# EasyEDA Pro project wireless charger controller.eprj, board PCB9
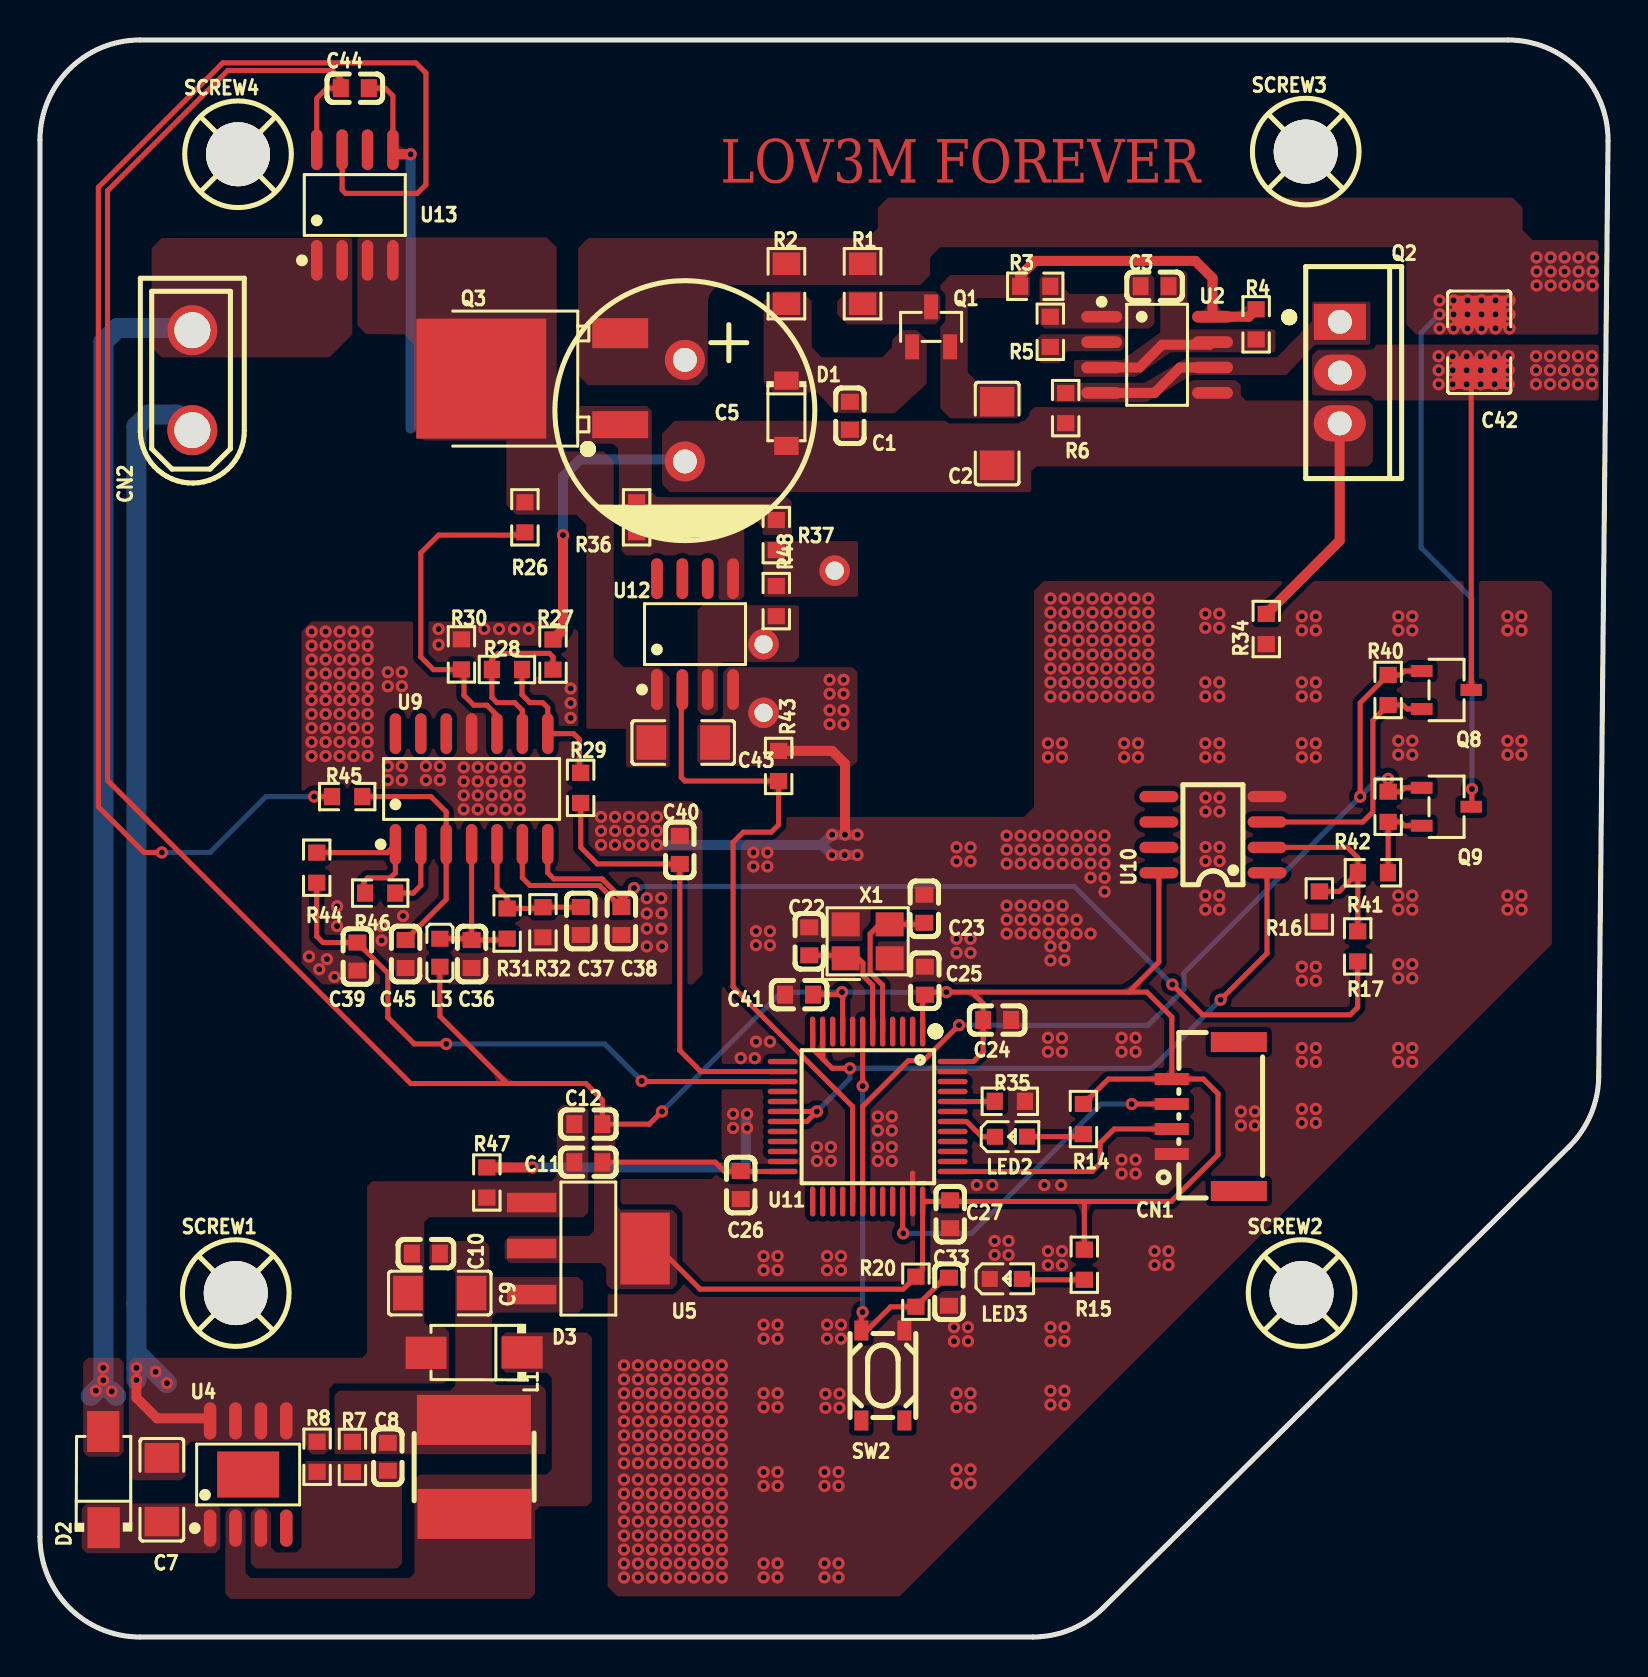
[diagram p10: board, top side]
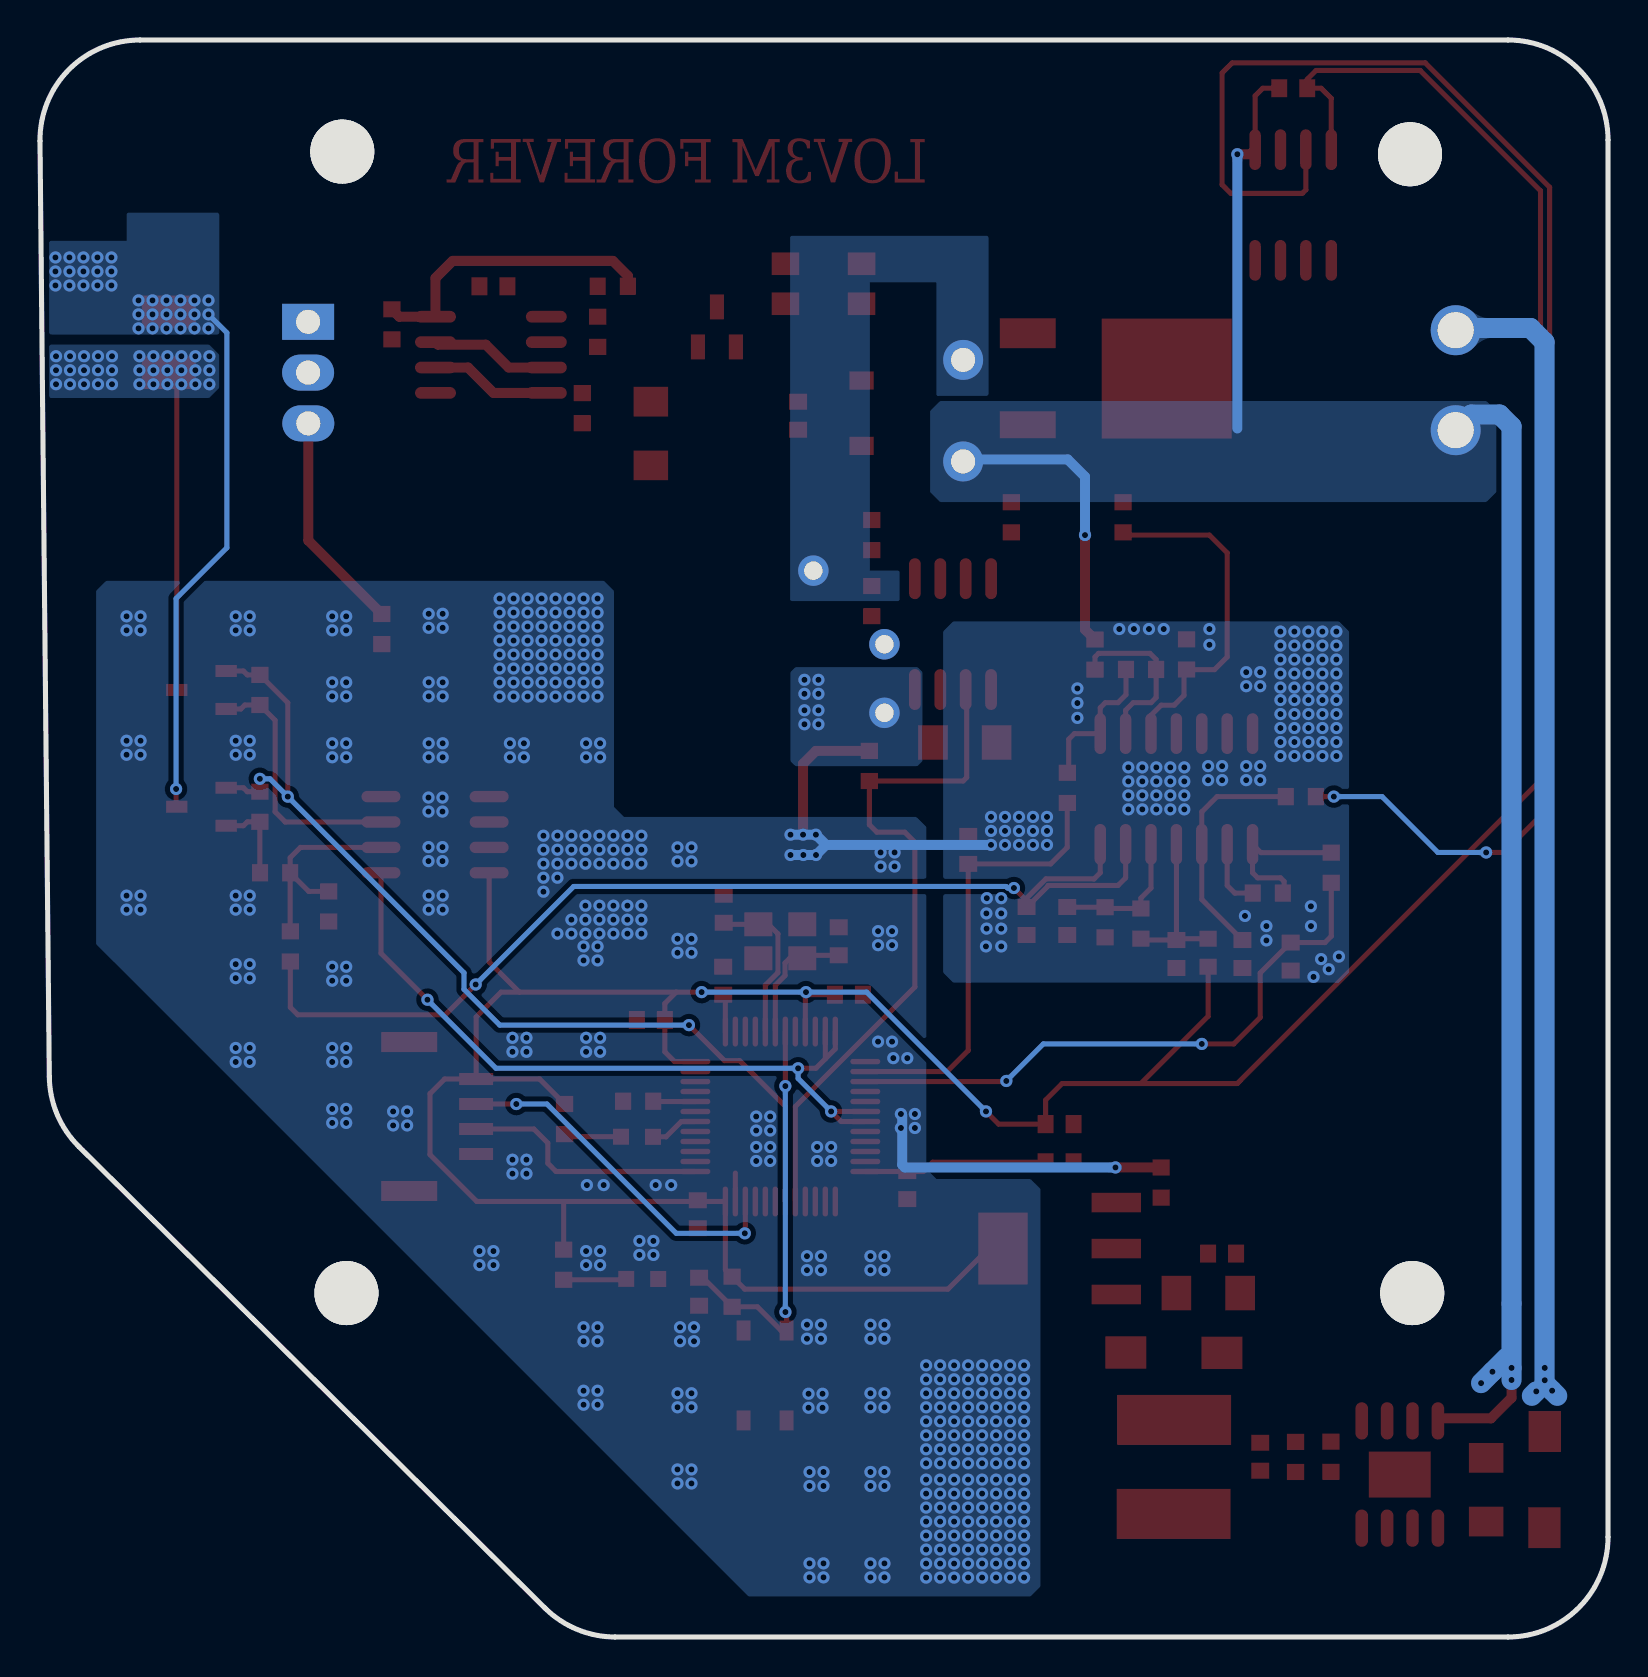
[diagram p11: board, bottom side, seen from below]

Outline 78.44 x 79.88 mm; copper layers: Top Layer, Bottom Layer. Coordinates in mm from the lower left corner of the outline.
Outline path: 0,74.88 0,5 arc(1.46,1.46) 5,0 49.66,0 arc(51.56,0.38) 53.17,1.45 76.49,24.53 arc(77.58,26.13) 77.97,28.03 78.44,74.83 arc(76.99,78.4) 73.44,79.88 5,79.88 arc(1.46,78.42) 0,74.88
Stack: Top Layer 0.035mm / Dielectric1 1.51mm FR4 er 4.5 / Bottom Layer 0.035mm

## Design rules (mm)
template: 自定义配置
spacing copperThickness1oz (default): track to track 0.102, other pairs 0.152 to 0.3
spacing copperThickness2oz: track to track 0.203, other pairs 0.152 to 0.3
track width copperThickness1oz (default): min 0.127, default 0.254, max 2.54
track width copperThickness2oz: min 0.203, default 0.254, max 2.54
differential pair differentialPair (default): width min 0.127, default 0.254, max 2.54; gap min 0.152, default 0.152
via viaSize (default): diameter min 0.5, default 0.61, max 10; hole min 0.3, default 0.305, max 6.3
net NET1 uses copperRegion1
net WGND uses copperRegion1
net NET2 uses copperRegion1
net $1N4125 uses copperRegion1
net $1N4124 uses copperRegion1
net $1N4176 uses copperRegion1
net $1N4254 uses copperRegion1
net +9.5V uses copperRegion1
net +3.3V uses copperRegion1
net GND uses copperRegion1
net INFORMATION+ uses copperRegion1
net 36V uses copperRegion1
net $1N4178 uses copperRegion1
net NET3 uses copperRegion1
net $1N4257 uses copperRegion1
net $1N4264 uses copperRegion1
net $1N4126 uses copperRegion1
net +36V uses copperRegion1
net GH uses copperRegion1
net HSO uses copperRegion1
net HSI uses copperRegion1

## Placement (name value [footprint] x y rotation side)
C1  100nF  [C0603]  40.51 61.09 90 top
C2  47uF  [C1206]  47.88 60.2 90 top
C3  1nF  [C0603]  55.75 67.56 180 top
C5  1000uF  [CAP-TH_BD13.0-P5.00-D1.2-FD]  32.26 61.34 270 top
C7  10uF  [C1206]  6.1 7.37 270 top
C8  33nF  [C0603]  17.4 9.02 270 top
C9  47uF  [C1206]  20 17.2 180 top
C10  100nF  [C0603]  19.3 19.18 180 top
C11  10uF  [C0603]  27.43 23.75 180 top
C12  100nF  [C0603]  27.43 25.65 180 top
C22  22pF  [C0603]  38.48 34.8 90 top
C23  22pF  [C0603]  44.24 36.43 270 top
C24  100nF  [C0603]  47.88 30.86 0 top
C25  100nF  [C0603]  44.26 32.83 90 top
C26  100nF  [C0603]  35.05 22.61 270 top
C27  100nF  [C0603]  45.53 21.15 270 top
C33  100nF  [C0603]  45.47 17.27 90 top
C36  100nF  [C0603]  21.59 34.16 90 top
C37  100nF  [C0603]  27.05 35.81 90 top
C38  100nF  [C0603]  29.08 35.81 90 top
C39  10nF  [C0603]  15.88 34.04 90 top
C40  10nF  [C0603]  32 39.37 90 top
C41  100nF  [C0603]  37.97 32.13 0 top
C42  47nF  [C1210]  71.99 64.76 90 top
C43  10uF  [C1206]  32.18 44.74 180 top
C44  100nF  [C0603]  15.75 77.47 0 top
C45  10nF  [C0603]  18.29 34.16 90 top
CN1  ZX-BX-GH1.25-LT4  [CONN-SMD_ZX-BX-GH1.25-LT4]  58.29 26.04 90 top
CN2  XT30UPB-M  [CONN-TH_XT30UPB-M]  7.62 62.87 90 top
D1  MMSZ5242B  [SOD-123_L2.7-W1.6-LS3.7-RD]  37.34 61.21 270 top
D2  SS510  [SMA_L4.3-W2.6-LS5.0-RD]  3.17 7.87 90 top
D3  SS510  [SMA_L4.3-W2.6-LS5.0-RD]  21.72 14.22 180 top
L1  100uH  [IND-SMD_L6.0-W6.0_FNR60XXS]  21.72 8.51 270 top
L3  10uH  [L0603]  20 34.23 270 top
LED2  NCD0603R1  [LED0603-RD_RED]  48.57 25.02 0 top
LED3  NCD0603R1  [LED0603-RD_RED]  48.31 17.91 0 top
NOREF  -  [Pad_e2022]  36.2 46.23 0 top
NOREF#2  -  [Pad_e529]  39.75 53.34 0 top
NOREF#3  -  [Pad_e1821]  36.2 49.66 0 top
Q1  MMBT5551  [SOT-23-3_L2.9-W1.3-P1.90-LS2.4-BR]  44.58 65.53 270 top
Q2  -  [IRF9540P_TO-220]  65.02 63.25 270 top
Q3  NCEP0178AK  [TO-252-2_L6.5-W6.1-P4.58-LS10.0-TL]  25.55 62.93 180 top
Q8  G01N20LE  [SOT-23-3_L2.9-W1.6-P1.90-LS2.8-BR]  70.36 47.37 180 top
Q9  G01N20LE  [SOT-23-3_L2.9-W1.6-P1.90-LS2.8-BR]  70.36 41.53 180 top
R1  330Ω  [R0805]  41.15 67.69 90 top
R2  100kΩ  [R0805]  37.34 67.69 90 top
R3  47kΩ  [R0603]  49.78 67.56 180 top
R4  47kΩ  [R0603]  60.83 65.66 90 top
R5  3.9kΩ  [R0603]  50.54 65.29 90 top
R6  20kΩ  [R0603]  51.31 61.47 90 top
R7  30kΩ  [R0603]  15.63 9.01 270 top
R8  4.7kΩ  [R0603]  13.86 9.02 270 top
R14  1kΩ  [R0603]  52.2 25.91 90 top
R15  1kΩ  [R0603]  52.24 18.62 90 top
R16  0Ω  [R0603]  63.99 36.54 90 top
R17  0Ω  [R0603]  65.91 34.54 90 top
R20  10kΩ  [R0603]  43.81 17.27 90 top
R26  15kΩ  [R0603]  24.26 56.01 90 top
R27  15kΩ  [R0603]  25.66 49.14 90 top
R28  1kΩ  [R0603]  23.36 48.4 180 top
R29  1kΩ  [R0603]  27.04 42.47 270 top
R30  1kΩ  [R0603]  21.08 49.15 90 top
R31  10kΩ  [R0603]  23.37 35.69 90 top
R32  10kΩ  [R0603]  25.16 35.75 270 top
R34  0Ω  [R0603]  61.34 50.42 90 top
R35  10kΩ  [R0603]  48.51 26.8 0 top
R36  4.7Ω  [R0603]  29.84 56.01 90 top
R37  10kΩ  [R0603]  36.83 55.12 90 top
R40  10kΩ  [R0603]  67.44 47.37 90 top
R41  0Ω  [R0603]  66.67 38.23 180 top
R42  10kΩ  [R0603]  67.44 41.53 90 top
R43  10kΩ  [R0603]  36.95 43.57 270 top
R44  100Ω  [R0603]  13.84 38.48 270 top
R45  100Ω  [R0603]  15.37 42.04 180 top
R46  10kΩ  [R0603]  17.02 37.21 180 top
R47  0Ω  [R0603]  22.35 22.73 270 top
R48  100Ω  [R0603]  36.83 51.82 270 top
SCREW1  -  [M3螺丝]  9.79 17.2 0 top
SCREW2  -  [M3螺丝]  63.11 17.2 0 top
SCREW3  -  [M3螺丝]  63.31 74.3 0 top
SCREW4  -  [M3螺丝]  9.91 74.17 0 top
SW2  TS3425BA  [SW-SMD_4P-L4.2-W3.2-P2.15-LS4.6-1]  42.16 13.08 90 top
U2  LM2904DR2G  [SOIC-8_L4.9-W3.9-P1.27-LS6.0-BL]  55.88 64.14 270 top
U4  XL7005A  [SOIC-8_L4.9-W3.9-P1.27-LS6.0-BL-EP3.1-1]  10.41 8.13 0 top
U5  SPX1117M3-L-3-3/TR  [SOT-223-4_L6.5-W3.5-P2.30-LS7.0-BR]  27.43 19.43 180 top
U9  TLV2374IDR  [SOIC-14_L8.7-W3.9-P1.27-LS6.0-BL]  21.59 42.42 0 top
U10  LM393DR  [SOIC-8_L5.0-W4.0-P1.27-LS6.0-BL]  58.67 40.13 90 top
U11  STM32F103C8T6  [LQFP-48_L7.0-W7.0-P0.50-LS9.0-BL]  41.4 26.04 180 top
U12  MX5014S  [SOIC-8_L4.9-W3.9-P1.27-LS6.0-BL]  32.77 50.17 0 top
U13  CC6920BSO-10A  [SOP-8_L5.0-W4.0-P1.27-LS6.0-BL]  15.75 71.63 0 top
X1  8MHz  [CRYSTAL-SMD_4P-L3.2-W2.5-BL]  41.4 34.8 0 top

## Footprints (pads in the part's own frame, mm; a bottom-side part is the same pattern mirrored in y, then rotated)
C0603
  rect 0.8x0.9 smd: 1(-0.7,0) 2(0.7,0)
C1206
  rect 1.485x1.728 smd: 1(-1.593,0) 2(1.593,0)
C1210
  rect 1.635x2.7 smd: 1(-1.518,0) 2(1.518,0)
CAP-TH_BD13.0-P5.00-D1.2-FD
  round 2 hole 1.2: 1(-2.54,0) 2(2.54,0)
CONN-SMD_ZX-BX-GH1.25-LT4
  rect 0.6x1.7 smd: 1(-1.875,1.675) 2(-0.625,1.675) 3(0.625,1.675) 4(1.875,1.675)
  rect 1x2.8 smd: 5(3.725,-1.675) 6(-3.725,-1.675)
CONN-TH_XT30UPB-M
  round 2.5 hole 1.8: 1(-2.5,0) 2(2.5,0)
CRYSTAL-SMD_4P-L3.2-W2.5-BL
  rect 1.4x1.2 smd: 1(-1.1,-0.85) 2(1.1,-0.85) 3(1.1,0.85) 4(-1.1,0.85)
IND-SMD_L6.0-W6.0_FNR60XXS
  rect 2.5x5.7 smd: 1(-2.35,-0.013) 2(2.35,0.013)
IRF9540P_TO-220
  rect 1.801x2.601 hole 1.199: 1(-2.54,0)
  oval 1.801x2.601 hole 1.199: 2(0,0) 3(2.54,-0.01)
L0603
  rect 0.8x0.864 smd: 1(-0.7,0) 2(0.7,0)
LED0603-RD_RED
  rect 0.8x0.8 smd: 1(-0.799,-0.004) 2(0.799,0.004)
LQFP-48_L7.0-W7.0-P0.50-LS9.0-BL
  oval 0.27x1.5 smd: 1(-2.75,-4.25) 2(-2.25,-4.25) 3(-1.75,-4.25) 4(-1.25,-4.25) 5(-0.75,-4.25) 6(-0.25,-4.25) 7(0.25,-4.25) 8(0.75,-4.25) 9(1.25,-4.25) 10(1.75,-4.25) 11(2.25,-4.25) 12(2.75,-4.25) 25(2.75,4.25) 26(2.25,4.25) 27(1.75,4.25) 28(1.25,4.25) 29(0.75,4.25) 30(0.25,4.25) 31(-0.25,4.25) 32(-0.75,4.25) 33(-1.25,4.25) 34(-1.75,4.25) 35(-2.25,4.25) 36(-2.75,4.25)
  oval 1.5x0.27 smd: 13(4.25,-2.75) 14(4.25,-2.25) 15(4.25,-1.75) 16(4.25,-1.25) 17(4.25,-0.75) 18(4.25,-0.25) 19(4.25,0.25) 20(4.25,0.75) 21(4.25,1.25) 22(4.25,1.75) 23(4.25,2.25) 24(4.25,2.75) 37(-4.25,2.75) 38(-4.25,2.25) 39(-4.25,1.75) 40(-4.25,1.25) 41(-4.25,0.75) 42(-4.25,0.25) 43(-4.25,-0.25) 44(-4.25,-0.75) 45(-4.25,-1.25) 46(-4.25,-1.75) 47(-4.25,-2.25) 48(-4.25,-2.75)
M3螺丝
  round 3.2 hole 3.2: 1(0,0)
Pad_e529
  round 1.524 hole 0.914: 1(0,0)
Pad_e1821
  round 1.524 hole 0.914: 1(0,0)
Pad_e2022
  round 1.524 hole 0.914: 1(0,0)
R0603
  rect 0.806x0.864 smd: 1(-0.753,0) 2(0.753,0)
R0805
  rect 1.133x1.377 smd: 1(-1,0) 2(1,0)
SMA_L4.3-W2.6-LS5.0-RD
  rect 2.046x1.62 smd: 1(-2.404,-0.009) 2(2.404,0.009)
SOD-123_L2.7-W1.6-LS3.7-RD
  rect 0.91x1.22 smd: 1(-1.635,0) 2(1.635,0)
SOIC-8_L4.9-W3.9-P1.27-LS6.0-BL
  oval 0.588x2.045 smd: 1(-1.905,-2.772) 2(-0.635,-2.772) 3(0.635,-2.772) 4(1.905,-2.772) 5(1.905,2.772) 6(0.635,2.772) 7(-0.635,2.772) 8(-1.905,2.772)
SOIC-8_L4.9-W3.9-P1.27-LS6.0-BL-EP3.1-1
  oval 0.63x1.865 smd: 1(-1.905,-2.683) 2(-0.635,-2.683) 3(0.635,-2.683) 4(1.905,-2.683) 5(1.905,2.683) 6(0.635,2.683) 7(-0.635,2.683) 8(-1.905,2.683)
  rect 3.1x2.3 smd: 9(0,0)
SOIC-8_L5.0-W4.0-P1.27-LS6.0-BL
  oval 0.569x1.95 smd: 1(-1.905,-2.705) 2(-0.635,-2.705) 3(0.635,-2.705) 4(1.905,-2.705) 5(1.905,2.705) 6(0.635,2.705) 7(-0.635,2.705) 8(-1.905,2.705)
SOIC-14_L8.7-W3.9-P1.27-LS6.0-BL
  oval 0.574x2.038 smd: 1(-3.81,-2.769) 2(-2.54,-2.769) 3(-1.27,-2.769) 4(0,-2.769) 5(1.27,-2.769) 6(2.54,-2.769) 7(3.81,-2.769) 8(3.81,2.769) 9(2.54,2.769) 10(1.27,2.769) 11(0,2.769) 12(-1.27,2.769) 13(-2.54,2.769) 14(-3.81,2.769)
SOP-8_L5.0-W4.0-P1.27-LS6.0-BL
  oval 0.574x2.035 smd: 1(-1.905,-2.768) 2(-0.635,-2.768) 3(0.635,-2.768) 4(1.905,-2.768) 5(1.905,2.768) 6(0.635,2.768) 7(-0.635,2.768) 8(-1.905,2.768)
SOT-23-3_L2.9-W1.3-P1.90-LS2.4-BR
  rect 1.25x0.7 smd: 1(1,-0.95) 2(1,0.95) 3(-1,0)
SOT-23-3_L2.9-W1.6-P1.90-LS2.8-BR
  rect 1.07x0.6 smd: 1(1.235,-0.95) 2(1.235,0.95) 3(-1.235,0)
SOT-223-4_L6.5-W3.5-P2.30-LS7.0-BR
  rect 2.47x0.98 smd: 1(2.835,-2.3) 2(2.835,0) 3(2.835,2.3)
  rect 2.47x3.6 smd: 4(-2.835,0)
SW-SMD_4P-L4.2-W3.2-P2.15-LS4.6-1
  rect 1x0.7 smd: 1(-2.25,1.075) 2(2.25,1.075) 3(-2.25,-1.075) 4(2.25,-1.075)
TO-252-2_L6.5-W6.1-P4.58-LS10.0-TL
  rect 2.8x1.35 smd: 1(-3.475,2.29)
  rect 2.8x1.5 smd: 3(-3.475,-2.29)
  rect 6.5x6 smd: 4(3.475,-0.017)

## Nets
As in the schematic, except:
GND: C22.2 C23.1 C24.2 C25.2 C26.2 C27.2 C33.1 C36.1 C37.1 C38.1 C39.1 C40.2 C41.1 C43.1 C45.1 CN1.1 LED3.1 NOREF.1 R16.1 R30.2 R32.2 R34.1 R35.2 R43.1 R47.1 SW2.4 U9.11 U10.4 U11.8 U11.23 U11.35 U11.47 U12.4 X1.2 X1.4
HSI: NOREF#3.1 R48.2 U12.3
HSO: C5.1 C42.2 NOREF#2.1 Q3.3 Q9.3 R1.2 R2.2 R37.1 R48.1

Pads without a net: CN1 5 6; SCREW1 1; SCREW2 1; SCREW3 1; SCREW4 1; SW2 1 3; U4 4 9; U9 12 13 14; U10 5 6 7; U11 2 3 4 10 13 16 17 20 21 22 25 26 27 28 31 32 33 38 39 40 41 43 45 46; U12 6 7 8; U13 6

## Via types
v1: diameter 0.61, hole 0.305, Top Layer to Bottom Layer, 691 vias

## Routing (per net, layer and track width the routed paths; a pad name or vN(x,y) marks a point on that pad's centre or on a via; arc(x,y) is an arc through that point)
+1.65V: length 55.6
  Top Layer w0.254: 29.08,36.83 29.08,36.96 28.12,37.92 25.71,37.92 25.4,38.23 U9.7 ; 29.08,36.83 C38.2 29.06,36.51 28.01,37.57 28.01,37.59 24.51,37.59 24.13,37.97 U9.6 ; 29.08,36.83 v1(29.72,37.47) ; v1(56.64,32.64) 58.16,31.12 65.54,31.12 65.91,31.5 R17.1
  Bottom Layer w0.254: v1(29.72,37.47) 30.04,37.47 30.11,37.54 51.74,37.54 v1(56.64,32.64)
+3.3V: length 197.5
  Top Layer w0.254: CN1.4 53.45,27.91 R14.2 ; CN1.4 56.62,31.01 55.37,32.26 54.46,32.26 ; CN1.4 58.2,27.91 58.93,27.18 58.93,24.13 56.58,21.79 52.31,21.79 ; C41.2 39.99,32.13 v1(40.12,32.26) 40.15,32.23 U11.9 ; U11.48 46.69,28.79 47.18,29.27 47.18,31.69 46.61,32.26 ; 52.31,21.79 U11.36 44.15,18.37 43.18,17.4 33.02,17.4 30.99,19.43 U5.4 ; 52.31,21.79 52.24,21.72 R15.2 ; 54.46,32.26 46.61,32.26 ; 54.46,32.26 55.97,33.77 55.97,38.23 ; v1(31.11,26.29) 30.48,25.65 C12.1 28.13,26.86 27.3,27.69 23.37,27.69 ; U13.8 13.84,76.96 14.35,77.47 C44.1 15.05,77.92 14.61,78.36 9.4,78.36 3.38,72.34 3.38,42.85 18.54,27.69 23.37,27.69 ; 46.61,32.26 v1(45.34,32.26) 44.45,32.26 44.15,31.96 U11.1 ; 23.37,27.69 20,31.05 L3.2 ; C11.1 33.78,23.75 34.25,23.29 U11.24
  Bottom Layer w0.254: v1(45.34,32.26) v1(40.12,32.26) 37.08,32.26 v1(31.11,26.29)
+36V: length 58.1
  Bottom Layer w1: CN2.2 7.51,65.48 3.88,65.48 3.17,64.77 3.17,12.7 v1(2.8,12.32) 2.54,12.06 ; v1(3.59,12.29) 3.81,12.06
  vias: v1(3.17,13.46) v1(3.17,12.84)
GND: length 36.4
  Top Layer w0.254: U11.35 43.65,23.2
  Top Layer w0.5: v1(40.27,40.13) 40.27,43.68 39.62,44.32 R43.1 ; R47.1 v1(24.64,23.49)
  Bottom Layer w0.5: v1(24.64,23.49) 35.17,23.49 35.31,23.62 35.31,26.1 v1(35.37,26.16) ; v1(30.86,39.62) 39.11,39.62 ; 39.11,39.62 v1(39.62,40.13) v1(40.27,40.13) v1(40.89,40.13) ; 39.11,39.62 v1(39.62,39.12) v1(40.25,39.12) v1(40.89,39.12)
  vias: v1(13.46,34.04) v1(13.59,50.29) v1(13.59,49.59) v1(13.59,48.89) v1(13.59,48.19) v1(13.59,47.49) v1(13.59,46.87) v1(13.59,46.17) v1(13.59,45.47) v1(13.59,44.77) v1(13.59,44.07) v1(13.97,33.4) v1(14.29,50.29) v1(14.29,49.59) v1(14.29,48.89) v1(14.29,48.19) v1(14.29,47.49) v1(14.29,46.87) v1(14.29,46.17) v1(14.29,45.47) v1(14.29,44.77) v1(14.29,44.07) v1(14.35,33.91) v1(14.73,33.02) v1(14.86,36.55) v1(14.86,35.56) v1(14.99,50.29) v1(14.99,49.59) v1(14.99,48.89) v1(14.99,48.19) v1(14.99,47.49) v1(14.99,46.87) v1(14.99,46.17) v1(14.99,45.47) v1(14.99,44.77) v1(14.99,44.07) v1(15.69,50.29) v1(15.69,49.59) v1(15.69,48.89) v1(15.69,48.19) v1(15.69,47.49) v1(15.69,46.87) v1(15.69,46.17) v1(15.69,45.47) v1(15.69,44.77) v1(15.69,44.07) v1(16.39,50.29) v1(16.39,49.59) v1(16.39,48.89) v1(16.39,48.19) v1(16.39,47.49) v1(16.39,46.87) v1(16.39,46.17) v1(16.39,45.47) v1(16.39,44.77) v1(16.39,44.07) v1(17.09,35.56) v1(17.09,34.84) v1(17.4,48.26) v1(17.4,47.56) v1(17.4,43.56) v1(17.4,42.86) v1(18.1,48.26) v1(18.1,47.56) v1(18.1,43.56) v1(18.1,42.86) v1(18.16,36.07) v1(19.3,43.56) v1(19.3,42.86) v1(19.94,50.42) v1(19.94,49.63) v1(20,43.56) v1(20,42.86) v1(21.2,43.5) v1(21.2,42.8) v1(21.2,42.1) v1(21.2,41.4) v1(21.89,43.5) v1(21.89,42.8) v1(21.89,42.1) v1(21.89,41.4) v1(22.23,50.42) v1(22.59,43.5) v1(22.59,42.8) v1(22.59,42.1) v1(22.59,41.4) v1(22.96,50.42) v1(23.3,43.5) v1(23.3,42.8) v1(23.3,42.1) v1(23.3,41.4) v1(23.72,50.42) v1(23.99,43.5) v1(23.99,42.8) v1(23.99,42.1) v1(23.99,41.4) v1(24.45,50.42) v1(26.54,47.45) v1(26.54,46.72) v1(26.54,45.97) v1(28.06,41.02) v1(28.06,40.32) v1(28.06,39.62) v1(28.76,41.02) v1(28.76,40.32) v1(28.76,39.62) v1(29.21,13.59) v1(29.21,12.89) v1(29.21,12.19) v1(29.21,11.49) v1(29.21,10.79) v1(29.21,10.09) v1(29.21,9.39) v1(29.21,8.69) v1(29.21,7.87) v1(29.21,7.17) v1(29.21,6.47) v1(29.21,5.77) v1(29.21,5.07) v1(29.21,4.37) v1(29.21,3.67) v1(29.21,2.97) v1(29.46,41.02) v1(29.46,40.32) v1(29.46,39.62) v1(29.91,13.59) v1(29.91,12.89) v1(29.91,12.19) v1(29.91,11.49) v1(29.91,10.79) v1(29.91,10.09) v1(29.91,9.39) v1(29.91,8.69) v1(29.91,7.87) v1(29.91,7.17) v1(29.91,6.47) v1(29.91,5.77) v1(29.91,5.07) v1(29.91,4.37) v1(29.91,3.67) v1(29.91,2.97) v1(30.16,41.02) v1(30.16,40.32) v1(30.16,39.62) v1(30.35,36.96) v1(30.35,36.2) v1(30.35,35.43) v1(30.35,34.54) v1(30.61,13.59) v1(30.61,12.89) v1(30.61,12.19) v1(30.61,11.49) v1(30.61,10.79) v1(30.61,10.09) v1(30.61,9.39) v1(30.61,8.69) v1(30.61,7.87) v1(30.61,7.17) v1(30.61,6.47) v1(30.61,5.77) v1(30.61,5.07) v1(30.61,4.37) v1(30.61,3.67) v1(30.61,2.97) v1(30.86,41.02) v1(30.86,40.32) v1(31.07,36.96) v1(31.1,36.2) v1(31.09,35.43) v1(31.12,34.54) v1(31.31,13.59) v1(31.31,12.89) v1(31.31,12.19) v1(31.31,11.49) v1(31.31,10.79) v1(31.31,10.09) v1(31.31,9.39) v1(31.31,8.69) v1(31.31,7.87) v1(31.31,7.17) v1(31.31,6.47) v1(31.31,5.77) v1(31.31,5.07) v1(31.31,4.37) v1(31.31,3.67) v1(31.31,2.97) v1(32.01,13.59) v1(32.01,12.89) v1(32.01,12.19) v1(32.01,11.49) v1(32.01,10.79) v1(32.01,10.09) v1(32.01,9.39) v1(32.01,8.69) v1(32.01,7.87) v1(32.01,7.17) v1(32.01,6.47) v1(32.01,5.77) v1(32.01,5.07) v1(32.01,4.37) v1(32.01,3.67) v1(32.01,2.97) v1(32.71,13.59) v1(32.71,12.89) v1(32.71,12.19) v1(32.71,11.49) v1(32.71,10.79) v1(32.71,10.09) v1(32.71,9.39) v1(32.71,8.69) v1(32.71,7.87) v1(32.71,7.17) v1(32.71,6.47) v1(32.71,5.77) v1(32.71,5.07) v1(32.71,4.37) v1(32.71,3.67) v1(32.71,2.97) v1(33.41,13.59) v1(33.41,12.89) v1(33.41,12.19) v1(33.41,11.49) v1(33.41,10.79) v1(33.41,10.09) v1(33.41,9.39) v1(33.41,8.69) v1(33.41,7.87) v1(33.41,7.17) v1(33.41,6.47) v1(33.41,5.77) v1(33.41,5.07) v1(33.41,4.37) v1(33.41,3.67) v1(33.41,2.97) v1(34.11,13.59) v1(34.11,12.89) v1(34.11,12.19) v1(34.11,11.49) v1(34.11,10.79) v1(34.11,10.09) v1(34.11,9.39) v1(34.11,8.69) v1(34.11,7.87) v1(34.11,7.17) v1(34.11,6.47) v1(34.11,5.77) v1(34.11,5.07) v1(34.11,4.37) v1(34.11,3.67) v1(34.11,2.97) v1(34.67,26.16) v1(34.67,25.46) v1(35.05,28.96) v1(35.37,25.46) v1(35.69,39.24) v1(35.69,38.54) v1(35.81,35.31) v1(35.81,34.61) v1(35.81,29.78) v1(35.75,28.96) v1(36.2,19.05) v1(36.2,18.35) v1(36.2,15.62) v1(36.2,14.92) v1(36.2,12.19) v1(36.2,11.49) v1(36.2,8.25) v1(36.2,7.56) v1(36.2,3.68) v1(36.2,2.98) v1(36.39,39.24) v1(36.39,38.54) v1(36.51,35.31) v1(36.51,34.61) v1(36.51,29.78) v1(36.89,19.05) v1(36.89,18.35) v1(36.89,15.62) v1(36.89,14.92) v1(36.89,12.19) v1(36.89,11.49) v1(36.89,8.25) v1(36.89,7.56) v1(36.89,3.68) v1(36.89,2.98) v1(38.86,24.51) v1(38.86,23.81) v1(39.24,8.25) v1(39.24,7.56) v1(39.24,3.68) v1(39.24,2.98) v1(39.29,12.17) v1(39.29,11.47) v1(39.37,19.05) v1(39.37,18.35) v1(39.37,15.62) v1(39.37,14.92) v1(39.5,47.88) v1(39.5,47.18) v1(39.5,46.36) v1(39.5,45.66) v1(39.56,24.51) v1(39.56,23.81) v1(39.94,8.25) v1(39.94,7.56) v1(39.94,3.68) v1(39.94,2.98) v1(39.99,12.17) v1(39.99,11.47) v1(40.07,19.05) v1(40.07,18.35) v1(40.07,15.62) v1(40.07,14.92) v1(40.2,47.88) v1(40.2,47.18) v1(40.2,46.36) v1(40.2,45.66) v1(41.91,26.04) v1(41.91,25.34) v1(41.91,24.51) v1(41.91,23.81) v1(42.61,26.04) v1(42.61,25.34) v1(42.61,24.51) v1(42.61,23.81) v1(45.72,15.49) v1(45.72,14.79) v1(45.85,39.5) v1(45.85,38.8) v1(45.85,34.93) v1(45.85,34.23) v1(45.85,12.19) v1(45.85,11.49) v1(45.85,8.38) v1(45.85,7.68) v1(46.42,15.49) v1(46.42,14.79) v1(46.55,39.5) v1(46.55,38.8) v1(46.55,34.93) v1(46.55,34.23) v1(46.55,12.19) v1(46.55,11.49) v1(46.55,8.38) v1(46.55,7.68) v1(46.86,22.61) v1(47.64,22.61) v1(47.75,19.81) v1(47.75,19.11) v1(48.35,40.08) v1(48.35,39.38) v1(48.35,38.68) v1(48.35,36.58) v1(48.35,35.88) v1(48.35,35.18) v1(48.45,19.81) v1(48.45,19.11) v1(49.05,40.08) v1(49.05,39.38) v1(49.05,38.68) v1(49.05,36.58) v1(49.05,35.88) v1(49.05,35.18) v1(49.75,40.08) v1(49.75,39.38) v1(49.75,38.68) v1(49.75,36.58) v1(49.75,35.88) v1(49.75,35.18) v1(50.24,22.61) v1(50.42,44.7) v1(50.42,44) v1(50.42,29.97) v1(50.42,29.27) v1(50.42,19.3) v1(50.42,18.6) v1(50.45,40.08) v1(50.45,39.38) v1(50.45,38.68) v1(50.45,36.58) v1(50.45,35.88) v1(50.45,35.18) v1(50.55,51.94) v1(50.55,51.24) v1(50.55,50.54) v1(50.55,49.84) v1(50.55,49.14) v1(50.55,48.44) v1(50.55,47.74) v1(50.55,47.04) v1(50.55,34.54) v1(50.55,33.84) v1(50.55,15.49) v1(50.55,14.79) v1(50.55,12.32) v1(50.55,11.62) v1(51.12,44.7) v1(51.12,44) v1(51.12,29.97) v1(51.12,29.27) v1(51.08,22.61) v1(51.12,19.3) v1(51.12,18.6) v1(51.15,40.08) v1(51.15,39.38) v1(51.15,38.68) v1(51.15,36.58) v1(51.15,35.88) v1(51.15,35.18) v1(51.25,51.94) v1(51.25,51.24) v1(51.25,50.54) v1(51.25,49.84) v1(51.25,49.14) v1(51.25,48.44) v1(51.25,47.74) v1(51.25,47.04) v1(51.25,34.54) v1(51.25,33.84) v1(51.25,15.49) v1(51.25,14.79) v1(51.25,12.32) v1(51.25,11.62) v1(51.85,40.08) v1(51.85,39.38) v1(51.85,38.68) v1(51.85,35.88) v1(51.85,35.18) v1(51.95,51.94) v1(51.95,51.24) v1(51.95,50.54) v1(51.95,49.84) v1(51.95,49.14) v1(51.95,48.44) v1(51.95,47.74) v1(51.95,47.04) v1(52.55,40.08) v1(52.55,39.38) v1(52.55,38.68) v1(52.55,37.98) v1(52.55,35.18) v1(52.65,51.94) v1(52.65,51.24) v1(52.65,50.54) v1(52.65,49.84) v1(52.65,49.14) v1(52.65,48.44) v1(52.65,47.74) v1(52.65,47.04) v1(53.25,40.08) v1(53.25,39.38) v1(53.25,38.68) v1(53.25,37.98) v1(53.25,37.28) v1(53.35,51.94) v1(53.35,51.24) v1(53.35,50.54) v1(53.35,49.84) v1(53.35,49.14) v1(53.35,48.44) v1(53.35,47.74) v1(53.35,47.04) v1(54.05,51.94) v1(54.05,51.24) v1(54.05,50.54) v1(54.05,49.84) v1(54.05,49.14) v1(54.05,48.44) v1(54.05,47.74) v1(54.05,47.04) v1(54.1,29.97) v1(54.1,29.27) v1(54.1,23.88) v1(54.1,23.18) v1(54.23,44.7) v1(54.23,44) v1(54.75,51.94) v1(54.75,51.24) v1(54.75,50.54) v1(54.75,49.84) v1(54.75,49.14) v1(54.75,48.44) v1(54.75,47.74) v1(54.75,47.04) v1(54.8,29.97) v1(54.8,29.27) v1(54.8,23.88) v1(54.8,23.18) v1(54.93,44.7) v1(54.93,44) v1(55.45,51.94) v1(55.45,51.24) v1(55.45,50.54) v1(55.45,49.84) v1(55.45,49.14) v1(55.45,48.44) v1(55.45,47.74) v1(55.45,47.04) v1(55.75,19.3) v1(55.75,18.6) v1(56.45,19.3) v1(56.45,18.6) v1(58.29,51.18) v1(58.29,50.48) v1(58.29,47.75) v1(58.29,47.05) v1(58.29,44.7) v1(58.29,44) v1(58.3,41.99) v1(58.3,41.29) v1(58.3,39.51) v1(58.3,38.81) v1(58.29,37.08) v1(58.29,36.38) v1(58.99,51.18) v1(58.99,50.48) v1(58.99,47.75) v1(58.99,47.05) v1(58.99,44.7) v1(58.99,44) v1(59,41.99) v1(59,41.29) v1(59,39.51) v1(59,38.81) v1(58.99,37.08) v1(58.99,36.38) v1(60.07,26.29) v1(60.07,25.59) v1(60.77,26.29) v1(60.77,25.59) v1(63.12,51.05) v1(63.12,50.35) v1(63.12,47.75) v1(63.12,47.05) v1(63.12,44.7) v1(63.12,44) v1(63.12,33.53) v1(63.12,32.83) v1(63.12,29.46) v1(63.12,28.76) v1(63.12,26.42) v1(63.12,25.72) v1(63.82,51.05) v1(63.82,50.35) v1(63.82,47.75) v1(63.82,47.05) v1(63.82,44.7) v1(63.82,44) v1(63.82,33.53) v1(63.82,32.83) v1(63.82,29.46) v1(63.82,28.76) v1(63.82,26.42) v1(63.82,25.72) v1(67.95,51.05) v1(67.95,50.35) v1(67.95,44.83) v1(67.95,44.13) v1(67.95,37.08) v1(67.95,36.38) v1(67.95,33.66) v1(67.95,32.95) v1(67.95,29.46) v1(67.95,28.76) v1(68.64,51.05) v1(68.64,50.35) v1(68.64,44.83) v1(68.64,44.13) v1(68.64,37.08) v1(68.64,36.38) v1(68.64,33.66) v1(68.64,32.95) v1(68.64,29.46) v1(68.64,28.76) v1(73.41,51.05) v1(73.41,50.35) v1(73.41,44.83) v1(73.41,44.13) v1(73.41,37.08) v1(73.41,36.38) v1(74.11,51.05) v1(74.11,50.35) v1(74.11,44.83) v1(74.11,44.13) v1(74.11,37.08) v1(74.11,36.38)
BOOT0: length 2.1
  Top Layer w0.254: U11.44 47.75,26.79 R35.1
F_ADC: length 76
  Top Layer w0.254: 15.11,74.4 15.11,72.39 15.29,72.21 18.87,72.21 19.3,72.64 19.3,78.23 18.8,78.74 9.14,78.74 2.92,72.52 2.92,41.53 5.21,39.24 v1(6.1,39.24) ; v1(13.72,42.04) R45.2
  Bottom Layer w0.254: v1(13.72,42.04) 11.3,42.04 8.51,39.24 v1(6.1,39.24)
HSO: length 26.1
  Top Layer w0.254: Q9.3 71.63,41.56 v1(71.63,42.42)
  Bottom Layer w0.254: v1(70.01,66.16) 69.09,65.24 69.09,54.48 71.63,51.94 v1(71.63,42.42)
  vias: v1(70.01,66.86) v1(70.01,65.46) v1(70.71,66.86) v1(70.71,66.16) v1(70.71,65.46) v1(71.41,66.86) v1(71.41,66.16) v1(71.41,65.46) v1(72.11,66.86) v1(72.11,66.16) v1(72.11,65.46) v1(72.81,66.86) v1(72.81,66.16) v1(72.81,65.46) v1(73.51,66.86) v1(73.51,66.16) v1(73.51,65.46) v1(74.86,69.01) v1(74.86,68.31) v1(74.86,67.61) v1(75.56,69.01) v1(75.56,68.31) v1(75.56,67.61) v1(76.26,69.01) v1(76.26,68.31) v1(76.26,67.61) v1(76.96,69.01) v1(76.96,68.31) v1(76.96,67.61) v1(77.66,69.01) v1(77.66,68.31) v1(77.66,67.61)
I_DETC: length 30.3
  Top Layer w0.254: v1(20.32,29.67) 18.72,29.67 17.4,30.99 17.4,33.21 C39.2 14.16,34.74 13.84,35.05 R44.2 ; v1(30.1,27.81) 30.13,27.79 U11.15
  Bottom Layer w0.254: v1(30.1,27.81) 28.25,29.67 v1(20.32,29.67)
INFORMATION+: length 15.8
  Top Layer w0.254: Q8.3 71.59,63.14
  vias: v1(69.96,64.06) v1(69.96,63.36) v1(69.96,62.66) v1(70.66,64.06) v1(70.66,63.36) v1(70.66,62.66) v1(71.36,64.06) v1(71.36,63.36) v1(71.36,62.66) v1(72.06,64.06) v1(72.06,63.36) v1(72.06,62.66) v1(72.76,64.06) v1(72.76,63.36) v1(72.76,62.66) v1(73.46,64.06) v1(73.46,63.36) v1(73.46,62.66) v1(74.83,64.06) v1(74.83,63.36) v1(74.83,62.66) v1(75.53,64.06) v1(75.53,63.36) v1(75.53,62.66) v1(76.23,64.06) v1(76.23,63.36) v1(76.23,62.66) v1(76.93,64.06) v1(76.93,63.36) v1(76.93,62.66) v1(77.63,64.06) v1(77.63,63.36) v1(77.63,62.66)
MCUIN: length 38.2
  Top Layer w0.254: 39.15,28.92 U11.11 ; 39.15,28.92 38.65,29.42 U11.12 ; 39.15,28.92 39.62,28.45 v1(40.51,28.45) ; U10.1 61.38,34.2 v1(59.05,31.88) ; U11.19 38.36,25.79 v1(38.86,26.29) 37.16,26.29 U11.18
  Bottom Layer w0.254: v1(59.05,31.88) 55.63,28.45 v1(40.51,28.45) 40.51,27.94 v1(38.86,26.29)
NET2: length 15.1
  Top Layer w0.5: R4.2 60.46,66.04 U2.8 58.65,67.98 57.79,68.83 49.78,68.83 49.03,68.09 R3.2
OSCIN: length 8.1
  Top Layer w0.254: C23.2 44.16,35.65 X1.3 42,35.65 41.52,35.17 41.52,33.23 42.15,32.6 U11.5
OSCOUT: length 6.5
  Top Layer w0.254: C22.1 40.15,34.1 X1.1 40.94,33.95 41.17,33.72 41.17,33.09 41.65,32.6 U11.6
PA8(HI): length 34.6
  Top Layer w0.254: 32.13,47.39 32.08,47.34 32.08,43 32.26,42.82 R43.2 36.95,40.63 36.58,40.26 35.18,40.26 34.67,39.75 34.67,32.51 40.65,26.53 U11.29
PA9(LI): length 49.2
  Top Layer w0.254: v1(67.44,42.93) R42.2 68.06,42.28 68.26,42.48 69.12,42.48 ; v1(45.97,30.61) 44.2,28.83 43.44,28.83 41.15,26.54 U11.30 ; v1(66.04,42.04) 66.04,46.73 R40.2 68.06,48.12 68.26,48.32 Q8.1
  Bottom Layer w0.254: v1(67.44,42.93) 66.93,42.93 v1(66.04,42.04) 57.23,33.22 57.23,32.4 55.44,30.61 v1(45.97,30.61)
PB6: length 2.4
  Top Layer w0.254: U11.42 46.35,25.79 47.12,25.02 LED2.1
REF_3.3: length 8.2
  Top Layer w0.254: 21.59,34.86 23.3,34.86 R31.1 ; 21.59,34.86 U9.4 ; 21.59,34.86 21.52,34.93 L3.1
RESET: length 20.5
  Top Layer w0.254: C33.2 45.27,17.97 R20.1 42.55,16.52 41.37,15.33 SW2.2 41.09,16.2 v1(41.15,16.26) ; U11.7 v1(41.15,27.56)
  Bottom Layer w0.254: v1(41.15,27.56) 41.15,16.26 v1(41.15,16.26)
SWCLK(PA14): length 12.4
  Top Layer w0.254: CN1.2 53.73,25.41 53.03,24.71 53.03,23.7 52.62,23.29 U11.37
SWDIO(PA13): length 17.7
  Top Layer w0.254: U11.34 43.15,20.22 v1(43.18,20.19) ; CN1.3 v1(54.61,26.66)
  Bottom Layer w0.254: v1(54.61,26.66) 53.08,26.66 46.61,20.19 v1(43.18,20.19)
V_DETC: length 22.4
  Top Layer w0.254: R29.2 27.05,41.71 27.05,39.5 27.88,38.67 C40.1 32,29.34 33.06,28.29 U11.14
WGND: length 102.6
  Top Layer w0.254: C44.2 17.27,77.47 17.65,77.09 U13.5
  Top Layer w0.5: Q2.3 65.01,54.84 R34.2 ; U13.5 17.88,74.17 v1(18.54,74.17) ; v1(4.83,12.86) 4.83,11.97 5.85,10.94 8.38,10.94 U4.8 ; R27.2 26.16,50.39 v1(26.16,55.12)
  Bottom Layer w0.254: 4.83,16.68 4.87,16.68
  Bottom Layer w0.5: 18.54,60.45 v1(18.54,74.17) ; C5.2 32.16,58.9 27.02,58.9 26.16,58.04 v1(26.16,55.12)
  Bottom Layer w1: v1(4.83,12.86) v1(4.83,13.46) 4.83,60.55 5.42,61.15 6.84,61.15 CN2.1 ; v1(6.35,12.7) v1(5.78,13.27) 5.08,13.97
$1N4124: length 6.1
  Top Layer w0.5: U2.7 58.53,64.64 56.13,64.64 54.99,63.5 U2.3
$1N4153: length 3.1
  Top Layer w0.254: 49.11,17.91 49.16,17.87 R15.1
$1N4194: length 10.8
  Top Layer w0.254: R41.2 65.92,38.98 65.4,39.5 U10.2 ; R41.2 65.92,35.31 R17.2 ; R41.2 64.99,37.29 R16.2
$1N4205: length 2.9
  Top Layer w0.254: LED2.2 52.07,25.03 R14.1
$1N4213: length 12.9
  Top Layer w0.254: Q8.2 68.39,46.42 68.19,46.62 R40.1 66.67,45.86 66.67,41.28 66.17,40.77 U10.3
$1N4222: length 7.1
  Top Layer w0.254: U9.5 22.86,37.47 23.37,36.96 R31.2 25.09,36.44 R32.1 27.04,36.5 C37.2
$1N4227: length 11.8
  Top Layer w0.254: R45.1 19.56,42.04 20.32,41.28 U9.3 20.32,36.9 18.29,34.86
$1N4229: length 7.9
  Top Layer w0.254: R46.2 16.2,37.27 16.2,37.79 16.38,37.97 17.53,37.97 17.78,38.23 U9.1 17.37,39.23 R44.1
$1N4236: length 8.8
  Top Layer w0.254: R27.1 25.66,49.02 25.48,49.2 22.91,49.2 22.61,48.9 R28.2 22.61,46.99 22.86,46.74 23.75,46.74 24.13,46.36 U9.9
$1N4237: length 17.5
  Top Layer w0.254: R26.1 24.12,55.12 19.94,55.12 19.05,54.23 19.05,49.02 19.69,48.39 21.07,48.39 R30.1 21.21,48.27 21.21,47.1 21.7,46.61 22.35,46.61 22.86,46.1 U9.10
$1N4241: length 7.5
  Top Layer w0.254: 24.11,48.4 24.11,47.13 24.51,46.74 25.15,46.74 25.4,46.48 U9.8 26.7,45.19 26.98,44.91 26.98,43.29 R29.1
$1N4257: length 6.1
  Top Layer w0.5: U2.6 57.02,63.5 55.75,62.23 U2.4
$1N4282: length 4.3
  Top Layer w0.254: R41.1 67.44,38.24 R42.1 68.06,40.78 68.26,40.58 Q9.2
$1N4299: length 3.5
  Top Layer w0.254: R46.1 18.67,37.21 19.05,37.59 U9.2

## Copper pours and planes (outline as drawn; the poured copper is in the pictures)
36V on Top Layer: 23.33,56.63 23.33,59.87 23.3,59.85 19.22,59.85 18.72,60.35 18.72,64.65 18.22,65.15 16.31,65.18 15.81,65.68 15.81,70.01 15.82,70.01 25.35,70.01 25.85,69.51 25.85,59.8 26.35,59.3 28.2,59.3 28.7,58.8 28.7,49.01 29.2,48.51 31,48.51 31.5,48.01 31.5,43.5 29.31,43.5 29.31,45.43 27.33,45.43 27.33,55.63 26.83,56.13 23.83,56.13
+3.3V on Top Layer: 23.49,20.07 27.46,20.07 27.71,20.32 27.71,26.35 27.96,26.6 28.53,26.6 28.78,26.35 28.78,21.63 29.03,21.38 31.63,21.38 31.88,21.13 31.88,17.65 31.63,17.4 28.57,17.4 28.32,17.65 28.32,18.45 28.07,18.7 23.49,18.7 23.24,18.95 23.24,19.82
+9.5V on Top Layer: 14.72,9.14 25.31,9.14 25.31,12.35 25.06,12.6 22.86,12.6 22.61,12.85 22.61,15.98 22.86,16.23 26.93,16.23 27.18,16.48 27.18,17.76 26.93,18.01 22.73,18.01 22.48,18.26 22.48,19.56 22.23,19.81 19.71,19.81 19.46,19.56 19.46,18.72 19.71,18.47 20.52,18.47 20.77,18.22 20.77,12.58 20.52,12.33 14.97,12.33 14.72,12.08
+36V on Top Layer: 2.41,9.02 3.94,9.02 4.19,9.27 4.19,13.72 3.94,13.97 2.41,13.97 2.16,13.72 2.16,9.27
+36V on Top Layer: 6.09,64.01 14.48,64.01 15.62,65.15 15.62,69.98 15.62,69.98 6.09,69.98 5.59,69.48 5.59,64.51
GND on Top Layer: 13.58,32.64 32.65,32.64 33.15,33.14 33.15,41.3 32.65,41.8 27.42,41.8 26.92,42.3 26.92,50.3 26.42,50.8 13.58,50.8 13.08,50.3 13.08,33.14
GND on Top Layer: 34.41,48.51 40.64,48.51 40.89,48.26 40.89,43.81 40.64,43.56 33.12,43.56 32.87,43.81 32.87,45.57 33.12,45.82 33.91,45.82 34.16,46.07 34.16,48.26
GND on Top Layer: 28.89,2.03 43,2.03 75.63,34.66 75.63,52.33 75.13,52.83 50.22,52.83 49.72,52.33 49.72,41.52 49.22,41.02 34.6,41.02 34.1,40.52 34.1,23.41 33.6,22.91 28.89,22.91 28.39,22.41 28.39,2.53
GND on Bottom Layer: 34.54,43.56 40.64,43.56 40.89,43.81 40.89,48.26 40.64,48.51 34.54,48.51 34.29,48.26 34.29,43.81
GND on Bottom Layer: 28.89,2.03 43,2.03 75.63,34.66 75.63,52.33 75.13,52.83 50.22,52.83 49.72,52.33 49.72,41.52 49.22,41.02 34.6,41.02 34.1,40.52 34.1,23.41 33.6,22.91 28.89,22.91 28.39,22.41 28.39,2.53
GND on Bottom Layer: 13.45,32.73 32.75,32.73 33.25,33.23 33.25,50.3 32.75,50.8 13.45,50.8 12.95,50.3 12.95,33.23
GH on Top Layer: 29.33,55.71 34.98,55.71 35.23,55.46 35.23,52.07 34.98,51.82 34.09,51.82 33.84,52.07 33.84,53.85 33.59,54.1 29.33,54.1 29.08,54.35 29.08,55.46
HSI on Top Layer: 33.14,46.1 33.66,46.1 33.91,46.35 33.91,48.52 34.16,48.77 37.72,48.77 37.97,49.02 37.97,51.6 37.96,51.61 33.14,51.61 32.89,51.36 32.89,46.35
HSO on Top Layer: 27.42,69.98 41.41,69.98 41.91,70.48 41.91,71.49 42.41,71.99 73.67,71.99 74.17,71.49 74.17,70.38 74.67,69.88 77.95,69.88 77.95,65.15 68.85,65.15 68.35,65.65 68.35,69.01 67.85,69.51 45.03,69.51 44.53,69.01 44.53,68.12 44.03,67.62 34.12,67.62 33.77,67.48 33.56,67.27 33.42,66.92 33.4,63.11 32.9,62.61 27.42,62.61 26.92,63.11 26.92,69.48
HSO on Top Layer: 36.17,54.82 40.92,54.82 40.92,52.03 36.17,52.03
HSO on Bottom Layer: 69.47,65.15 77.98,65.15 77.98,69.84 74.1,69.84 74.1,71.25 69.47,71.25
HSO on Bottom Layer: 35.43,51.82 40.91,51.82 40.91,70.09 30.99,70.09 30.99,61.83 33.6,61.83 33.6,67.76 36.93,67.76 36.93,53.35 35.43,53.35
INFORMATION+ on Top Layer: 63.63,64.64 77.98,64.64 77.98,61.85 63.63,61.85
INFORMATION+ on Bottom Layer: 69.97,61.98 77.98,61.98 77.98,64.64 69.97,64.64 69.47,64.14 69.47,62.48
NET1 on Top Layer: 36.2,66.81 36.2,62.75 36.7,62.25 38.85,62.25 39.35,61.75 39.35,61.71 39.85,61.21 42.76,61.21 44.35,62.69 44.35,64.88 43.85,65.38 43.12,65.38 42.62,64.88 42.62,64.51 42.12,64.01 39.11,64.01 38.61,64.51 38.61,66.81 38.11,67.31 36.7,67.31
NET2 on Top Layer: 45.03,67.62 45.03,61.46 45.53,60.96 48.87,60.96 49.12,61.21 49.12,62.52 48.87,62.76 46.91,62.76 46.41,63.26 46.41,66.48 46.91,66.98 49.4,66.98 49.52,67.1 49.52,68.01 49.4,68.12 45.53,68.12
NET3 on Top Layer: 40.38,67.31 44.79,67.31 45.04,67.06 45.04,65.91 44.79,65.66 40.38,65.66 39.88,66.16 39.88,66.81
WGND on Top Layer: 4.69,7.84 7.05,7.84 7.3,8.09 7.3,9.53 7.55,9.78 13.09,9.78 13.34,9.53 13.34,9.38 13.59,9.13 14.23,9.13 14.48,9.38 14.48,12.43 14.73,12.68 20.21,12.68 20.46,12.93 20.46,15.25 20.21,15.5 19.47,15.5 19.22,15.75 19.22,20.75 19.47,21 27.18,21 27.43,21.25 27.43,26.35 27.18,26.6 26.1,26.6 25.85,26.35 25.85,23.05 25.6,22.8 16.61,22.8 16.36,22.55 16.36,14.22 16.11,13.97 4.69,13.97 4.44,13.72 4.44,8.09
WGND on Top Layer: 31.11,60.19 31.75,60.83 49.24,60.83 49.49,61.08 49.49,61.27 49.74,61.52 57.09,61.52 57.34,61.77 57.34,62.62 57.59,62.87 59.82,62.87 60.07,62.62 60.07,62.1 60.32,61.85 66.42,61.85 66.67,61.6 66.67,58.8 66.42,58.55 49.83,58.55 49.58,58.3 49.58,57.27 31.5,57.27 31.11,57.66 31.11,60.19
WGND on Bottom Layer: 5.59,61.33 5.59,57.27 6.09,56.77 33.41,56.77 33.91,57.27 33.91,61.33 33.41,61.83 6.09,61.83
$1N4124 on Top Layer: 56.03,68.27 56.03,65.24 54.13,63.88 51.71,63.88 51.71,63.03 54.79,63.03 56.56,64.26 61.8,64.26 61.8,65.41 57.4,65.41 57.4,68.2 57.28,68.33 56.09,68.33
$1N4125 on Top Layer: 50,67.94 50,65.7 50.25,65.45 55.5,65.45 55.75,65.7 55.75,67.96 55.5,68.21 54.7,68.21 54.45,67.96 54.45,67.43 54.2,67.18 51.51,67.18 51.26,67.43 51.26,67.94 51.01,68.19 50.25,68.19
$1N4126 on Top Layer: 50.08,65.16 54.06,65.16 54.26,64.96 54.26,64.51 54.06,64.31 51.4,64.31 51.2,64.11 51.2,63.92 51,63.72 50.08,63.72 49.88,63.92 49.88,64.96
$1N4176 on Top Layer: 2.34,4.19 8.77,4.19 9.02,4.44 9.02,6.43 8.77,6.68 2.34,6.68 2.09,6.43 2.09,4.44
$1N4178 on Top Layer: 9.52,6.48 10.04,6.48 10.29,6.23 10.29,3.2 10.54,2.95 18.48,2.95 18.73,3.2 18.73,7.88 18.98,8.13 25.35,8.13 25.6,8.38 25.6,12.97 25.35,13.22 23.3,13.22 23.05,13.47 23.05,14.99 23.3,15.24 27.36,15.24 27.61,14.99 27.61,6.79 27.36,6.54 25.02,6.54 24.77,6.29 24.77,2.16 24.52,1.91 9.52,1.91 9.27,2.16 9.27,6.23
$1N4254 on Top Layer: 10.79,6.48 11.31,6.48 11.56,6.23 11.56,4.48 11.81,4.23 12.83,4.23 13.08,4.48 13.08,8.55 13.33,8.8 17.86,8.8 18.11,8.55 18.11,3.68 17.86,3.43 10.79,3.43 10.54,3.68 10.54,6.23
$1N4257 on Top Layer: 57.4,64.01 55.24,62.73 50.7,62.73 50.7,61.77 55.36,61.77 57.61,63.12 62.34,63.12 63.79,64.64 66.55,64.64 66.55,66.8 63.63,66.8 63.63,65.81 61.87,64.01
$1N4264 on Top Layer: 28.67,59.69 27.05,59.69 26.8,59.94 26.8,61.32 27.05,61.57 30.36,61.57 30.61,61.32 30.61,57.27 30.86,57.02 37.36,57.02 37.61,56.77 37.61,55.11 36.15,55.11 36.15,55.52 35.9,55.77 29.17,55.77 28.92,56.02 28.92,59.44

Small or netless copper shapes (teardrops, artwork), in the pictures only: 181 on Top Layer, 43 on Bottom Layer

## Text on the board
Top Layer: LOV3M FOREVER
Top Solder Mask Layer: CMeSummer
